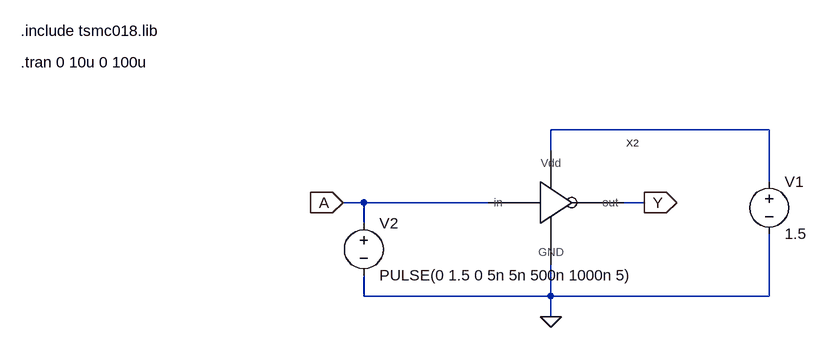
[diagram p0: schematic resistive_load_inverter_tb.asc]
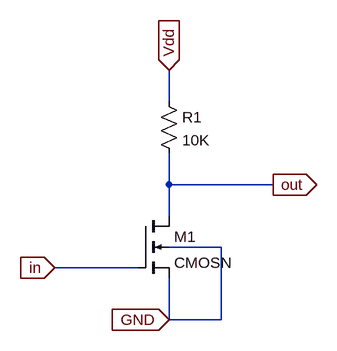
[diagram p1: sub-circuit resistive_load_inverter.asc]
resistive_load_inverter_tb.asc, the LTspice schematic file:
Version 4
SHEET 1 880 680
WIRE 576 80 240 80
WIRE 240 112 240 80
WIRE 576 160 576 80
WIRE -48 192 -80 192
WIRE 144 192 -48 192
WIRE 384 192 352 192
WIRE -48 224 -48 192
WIRE -48 336 -48 304
WIRE 240 336 240 288
WIRE 240 336 -48 336
WIRE 576 336 576 240
WIRE 576 336 240 336
WIRE 240 368 240 336
FLAG 240 368 0
FLAG 384 192 Y
IOPIN 384 192 Out
FLAG -80 192 A
IOPIN -80 192 In
SYMBOL resistive_load_inverter 224 192 R0
SYMATTR InstName X2
SYMBOL voltage 576 144 R0
WINDOW 123 0 0 Left 0
WINDOW 39 0 0 Left 0
SYMATTR InstName V1
SYMATTR Value 1.5
SYMBOL voltage -48 208 R0
WINDOW 123 0 0 Left 0
WINDOW 39 0 0 Left 0
SYMATTR InstName V2
SYMATTR Value PULSE(0 1.5 0 5n 5n 500n 1000n 5)
TEXT -576 -72 Left 2 !.include tsmc018.lib
TEXT -576 -24 Left 2 !.tran 0 10u 0 100u

resistive_load_inverter.asc, the sub-circuit schematic file:
Version 4
SHEET 1 880 680
WIRE 256 32 256 -16
WIRE 256 160 256 112
WIRE 416 160 256 160
WIRE 256 208 256 160
WIRE 336 256 256 256
WIRE 208 288 80 288
WIRE 256 368 256 304
WIRE 336 368 336 256
WIRE 336 368 256 368
FLAG 416 160 out
IOPIN 416 160 Out
FLAG 256 -16 Vdd
IOPIN 256 -16 In
FLAG 80 288 in
IOPIN 80 288 In
FLAG 256 368 GND
IOPIN 256 368 In
SYMBOL cmosn 208 208 R0
SYMATTR InstName M1
SYMATTR Value2 l=180n w=1u
SYMBOL res 240 16 R0
SYMATTR InstName R1
SYMATTR Value 10K

The netlist it stands for:
* resistive_load_inverter_tb.asc
XX2 N001 0 Y A resistive_load_inverter
V1 N001 0 1.5
V2 A 0 PULSE(0 1.5 0 5n 5n 500n 1000n 5)

* block symbol definitions
.subckt resistive_load_inverter Vdd GND out in
M1 out in GND GND CMOSN l=180n w=1u
R1 Vdd out 10K
.ends resistive_load_inverter

.model NMOS NMOS
.model PMOS PMOS
.lib standard.mos
.include tsmc018.lib
.tran 0 10u 0 100u
.backanno
.end